# Altium schematic sheet ALU_ONES.SchDoc
size B; Author: E. Sims; Organization: Let's Build Rockets Inc.; SheetNumber: 17; SheetTotal: 17
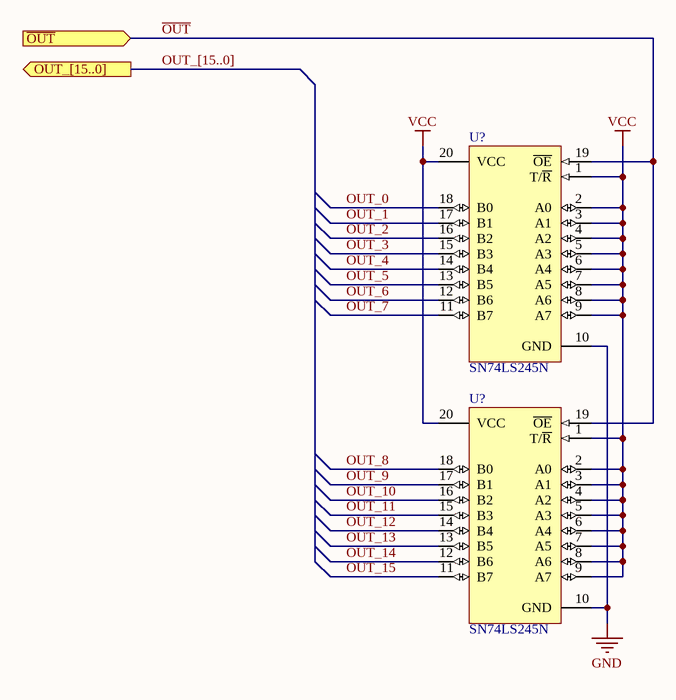
[diagram p0: ALU_ONES.SchDoc]

## Parts
(Parts that share a designator on the sheet are numbered #1, #2 ... from top to bottom, then left to right.)
U?#1  SN74LS245N  [N020]
U?#2  SN74LS245N  [N020]

## Ports
OUT_[15..0] (out), ~{OUT} (in)

## Nets
GND: U?#1.10(GND) U?#2.10(GND)
VCC: U?#1.1(T/~{R}) U?#1.2(A0) U?#1.3(A1) U?#1.4(A2) U?#1.5(A3) U?#1.6(A4) U?#1.7(A5) U?#1.8(A6) U?#1.9(A7) U?#1.20(VCC) U?#2.1(T/~{R}) U?#2.2(A0) U?#2.3(A1) U?#2.4(A2) U?#2.5(A3) U?#2.6(A4) U?#2.7(A5) U?#2.8(A6) U?#2.9(A7) U?#2.20(VCC)
~{OUT}: U?#1.19(~{OE}) U?#2.19(~{OE}) ; port ~{OUT}
OUT_0: U?#1.18(B0)
OUT_1: U?#1.17(B1)
OUT_2: U?#1.16(B2)
OUT_3: U?#1.15(B3)
OUT_4: U?#1.14(B4)
OUT_5: U?#1.13(B5)
OUT_6: U?#1.12(B6)
OUT_7: U?#1.11(B7)
OUT_8: U?#2.18(B0)
OUT_9: U?#2.17(B1)
OUT_10: U?#2.16(B2)
OUT_11: U?#2.15(B3)
OUT_12: U?#2.14(B4)
OUT_13: U?#2.13(B5)
OUT_14: U?#2.12(B6)
OUT_15: U?#2.11(B7)

## Buses and harness runs
bus OUT_[15..0] = port OUT_[15..0]

## Notes on the sheet
- Let's Build Rocket's Inc. Modular Paylaod System Based on TMP-010 Rev
  For more information visit https://github.com/LetsBuildRockets/Modular-Payload-System
  This work is licensed under CC BY-NC 4.0. To view a copy of this license, visit https://creativecommons.org/licenses/by-nc/4.0
- Title
- Size:
- Date:
- Assembly Variant:
- B
- Number:
- Time:
- Revision:
- Sheet
- of
- Author:
- File:

## Library data of the parts
U?#1 U?#2 = SN74LS245N: Octal Bus Transceiver with 3-State Outputs; Published: 8-Jun-2000; LatestRevisionDate: 04-Mar-2005; LatestRevisionNote: Stylized 3D Model Added.; DatasheetVersion: Mar-1988; PackageVersion: Oct-1995; PackageReference: N020; Publisher: Altium Limited; PackageDescription: DIP; 20 Leads; Row Spacing 7.62 mm; Pitch 2.54 mm; ComponentLink1Description: Manufacturer Link; ComponentLink1URL: http://www.ti.com/; ComponentLink2Description: Datasheet; ComponentLink2URL: http://www-s.ti.com/sc/ds/sn74ls245.pdf